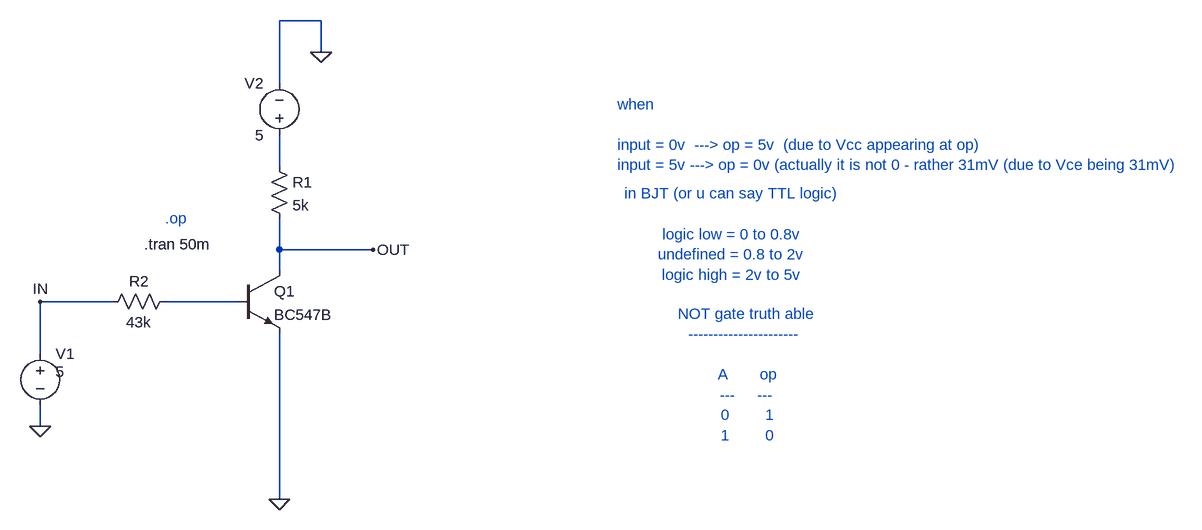
[diagram p0: schematic BJT_as_NOT_gate.asc]
BJT_as_NOT_gate.asc, the LTspice schematic file:
Version 4.1
SHEET 1 1836 1036
WIRE 416 -320 352 -320
WIRE 416 -272 416 -320
WIRE 352 -224 352 -320
WIRE 352 -96 352 -144
WIRE 352 32 352 -16
WIRE 496 32 352 32
WIRE 352 64 352 32
WIRE 96 112 -16 112
WIRE 288 112 176 112
WIRE -16 192 -16 112
WIRE -16 304 -16 272
WIRE 352 416 352 160
FLAG 352 416 0
FLAG 496 32 OUT
FLAG -16 112 IN
FLAG -16 304 0
FLAG 416 -272 0
SYMBOL voltage -16 176 R0
WINDOW 3 24 44 Left 2
WINDOW 123 0 0 Left 0
WINDOW 39 0 0 Left 0
SYMATTR Value 5
SYMATTR InstName V1
SYMBOL npn 288 64 R0
SYMATTR InstName Q1
SYMATTR Value BC547B
SYMBOL voltage 352 -128 R180
WINDOW 0 24 96 Left 2
WINDOW 3 24 16 Left 2
WINDOW 123 0 0 Left 0
WINDOW 39 0 0 Left 0
SYMATTR InstName V2
SYMATTR Value 5
SYMBOL res 336 -112 R0
SYMATTR InstName R1
SYMATTR Value 5k
SYMBOL res 192 96 R90
WINDOW 0 0 56 VBottom 2
WINDOW 3 32 56 VTop 2
SYMATTR InstName R2
SYMATTR Value 43k
TEXT 144 24 Left 2 !.tran 50m
TEXT 176 -16 Left 2 ;.op
TEXT 872 -192 Left 2 ;when\n \ninput = 0v  ---> op = 5v  (due to Vcc appearing at op)\ninput = 5v ---> op = 0v (actually it is not 0 - rather 31mV (due to Vce being 31mV)
TEXT 1048 8 Center 2 ;in BJT (or u can say TTL logic)\n \nlogic low = 0 to 0.8v\nundefined = 0.8 to 2v\nlogic high = 2v to 5v
TEXT 1072 224 Center 2 ;NOT gate truth able\n----------------------\n \nA       op\n---     ---\n0        1\n1        0

The netlist it stands for:
* BJT_as_NOT_gate.asc
V1 IN 0 5
Q1 OUT N002 0 0 BC547B
V2 N001 0 5
R1 N001 OUT 5k
R2 N002 IN 43k
.model NPN NPN
.model PNP PNP
.lib standard.bjt
.tran 50m
* .op
* when
* input = 0v  ---> op = 5v  (due to Vcc appearing at op)
* input = 5v ---> op = 0v (actually it is not 0 - rather 31mV (due to Vce being 31mV)
* in BJT (or u can say TTL logic)
* logic low = 0 to 0.8v
* undefined = 0.8 to 2v
* logic high = 2v to 5v
* NOT gate truth able
* ----------------------
* A       op
* ---     ---
* 0        1
* 1        0
.backanno
.end